# EAGLE schematic ottawa-badge-mini-r1 (EAGLE 5.12)
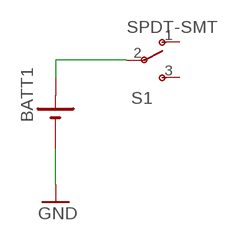
[diagram p0: schematic, sheet 1]

## Parts
BATT1  2032SMD  [2032SMD]
S1  SPDT-SMT  [SPDT-SMT]

## Nets
GND: BATT1.-
N$1: BATT1.+ S1.2(P)
Unconnected: S1.1(O) S1.3(S)

## Library data of the parts
BATT1 = rbg-4ucon-battery:2032SMD
S1 = smt-spdt-aliexpress:SPDT-SMT